# EAGLE design altimeter_new (EAGLE 9.3.1)
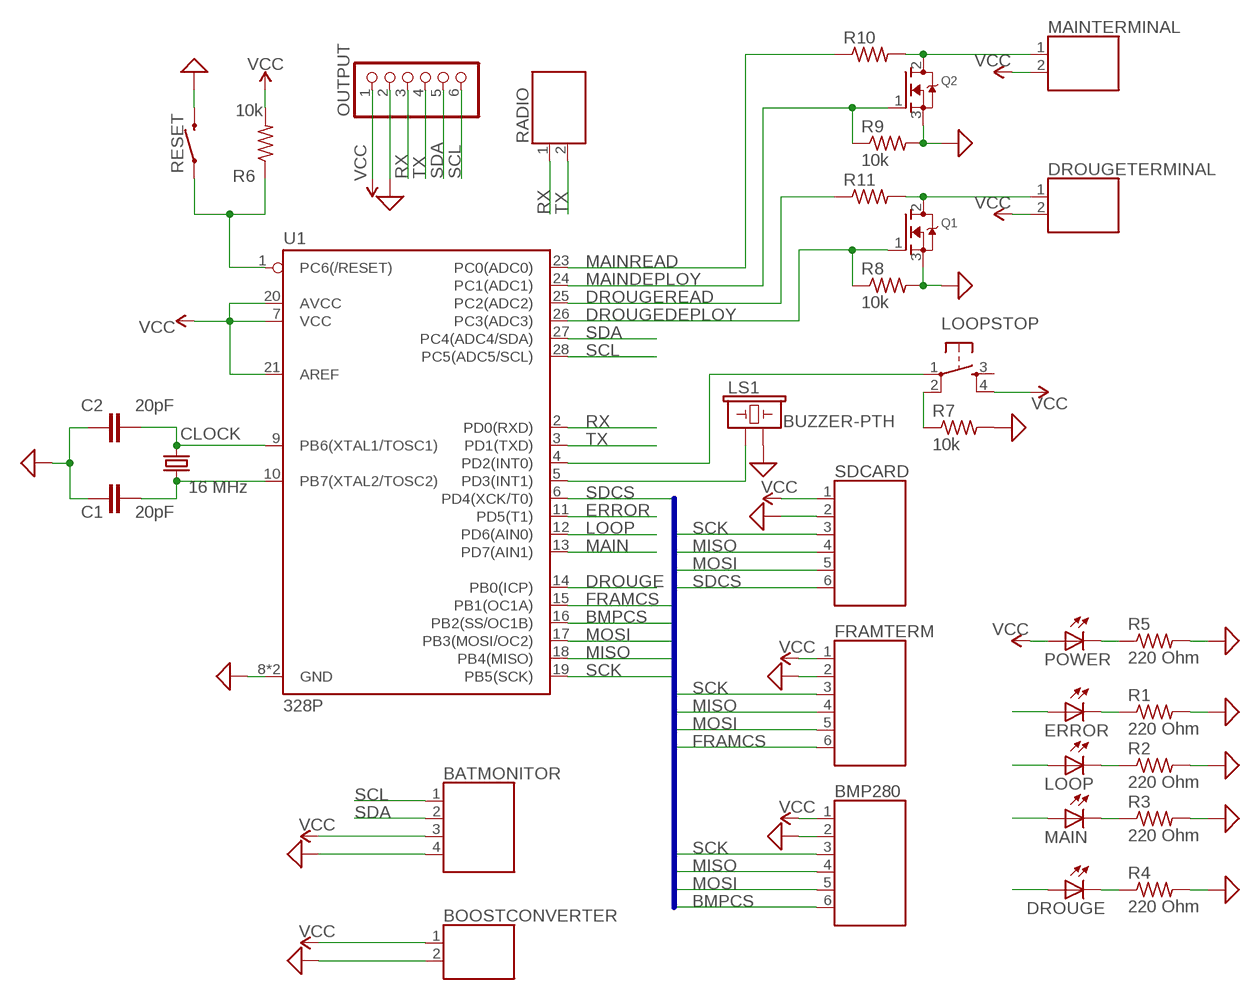
[diagram p0: schematic, sheet 1]

## Parts
BATMONITOR  691386700004  [691386700004]
BMP280  691386700006  [691386700006]
BOOSTCONVERTER  691386700002  [691386700002]
C1  20pF  22PF-PTH-2.54MM-200V-5%  [CAP-PTH-2.54]
C2  20pF  22PF-PTH-2.54MM-200V-5%  [CAP-PTH-2.54]
CLOCK  16 MHz  CRYSTALHC49U-V  [HC49U-V]
DROUGE  LED5MM  [LED5MM]
DROUGETERMINAL  691386700002  [691386700002]
ERROR  LED5MM  [LED5MM]
FRAMTERM  691386700006  [691386700006]
LOOP  LED5MM  [LED5MM]
LOOPSTOP  TAC_SWITCHPTH  [TACTILE-PTH]
LS1  BUZZER-PTH  [BUZZER-12MM]
MAIN  LED5MM  [LED5MM]
MAINTERMINAL  691386700002  [691386700002]
OUTPUT  PINHD-1X6  [1X06]
POWER  LED5MM  [LED5MM]
Q1  MOSFET-NGDS_TO220V  [TO220V]
Q2  MOSFET-NGDS_TO220V  [TO220V]
R1  220 Ohm  R-US_0204/7  [0204/7]
R2  220 Ohm  R-US_0204/7  [0204/7]
R3  220 Ohm  R-US_0204/7  [0204/7]
R4  220 Ohm  R-US_0204/7  [0204/7]
R5  220 Ohm  R-US_0204/7  [0204/7]
R6  10k  R-US_0204/7  [0204/7]
R7  10k  R-US_0204/7  [0204/7]
R8  10k  R-US_0204/7  [0204/7]
R9  10k  R-US_0204/7  [0204/7]
R10  R-US_0204/7  [0204/7]
R11  R-US_0204/7  [0204/7]
RADIO  691386700002  [691386700002]
RESET  MOMENTARY-SWITCH-SPST-PTH-6.0MM  [TACTILE_SWITCH_PTH_6.0MM]
SDCARD  691386700006  [691386700006]
U1  328P  ATMEGA328P_PDIP  [DIP28]

## Nets
BMPCS: BMP280.6 U1.16(PB2(SS/OC1B))
DROUGE: DROUGE.A U1.14(PB0(ICP))
DROUGEDEPLOY: Q1.1(G) R8.1 U1.26(PC3(ADC3))
DROUGEREAD: R11.1 U1.25(PC2(ADC2))
ERROR: ERROR.A U1.11(PD5(T1))
FRAMCS: FRAMTERM.6 U1.15(PB1(OC1A))
GND: BATMONITOR.4 BMP280.2 BOOSTCONVERTER.2 C1.1 C2.1 FRAMTERM.2 LS1.- OUTPUT.2 Q1.3(S) Q2.3(S) R1.2 R2.2 R3.2 R4.2 R5.2 R7.2 R8.2 R9.2 RESET.3 SDCARD.2 U1.8(GND) U1.22(GND) ; supply symbol labelled SUP
LOOP: LOOP.A U1.12(PD6(AIN0))
MAIN: MAIN.A U1.13(PD7(AIN1))
MAINDEPLOY: Q2.1(G) R9.1 U1.24(PC1(ADC1))
MAINREAD: R10.1 U1.23(PC0(ADC0))
MISO: BMP280.4 FRAMTERM.4 SDCARD.4 U1.18(PB4(MISO))
MOSI: BMP280.5 FRAMTERM.5 SDCARD.5 U1.17(PB3(MOSI/OC2))
N$1: C1.2 CLOCK.1 U1.10(PB7(XTAL2/TOSC2))
N$2: C2.2 CLOCK.2 U1.9(PB6(XTAL1/TOSC1))
N$3: POWER.K(C) R5.1
N$4: LOOPSTOP.2 R7.1
N$5: LOOPSTOP.1 U1.4(PD2(INT0))
N$7: LS1.+ U1.5(PD3(INT1))
N$11: DROUGETERMINAL.1 Q1.2(D) R11.2
N$12: ERROR.K(C) R1.1
N$13: LOOP.K(C) R2.1
N$14: MAIN.K(C) R3.1
N$15: DROUGE.K(C) R4.1
N$19: MAINTERMINAL.1 Q2.2(D) R10.2
N$21: R6.1 RESET.1 U1.1(PC6(/RESET))
RX: OUTPUT.3 RADIO.1 U1.2(PD0(RXD))
SCK: BMP280.3 FRAMTERM.3 SDCARD.3 U1.19(PB5(SCK))
SCL: BATMONITOR.1 OUTPUT.6 U1.28(PC5(ADC5/SCL))
SDA: BATMONITOR.2 OUTPUT.5 U1.27(PC4(ADC4/SDA))
SDCS: SDCARD.6 U1.6(PD4(XCK/T0))
TX: OUTPUT.4 RADIO.2 U1.3(PD1(TXD))
VCC: BATMONITOR.3 BMP280.1 BOOSTCONVERTER.1 DROUGETERMINAL.2 FRAMTERM.1 LOOPSTOP.4 MAINTERMINAL.2 OUTPUT.1 POWER.A R6.2 SDCARD.1 U1.7(VCC) U1.20(AVCC) U1.21(AREF)
Unconnected: LOOPSTOP.3

## Buses
SPIBUS:BMPCS,FRAMCS,GND,MISO,MOSI,SCK,SDCS,VCC

## Library data of the parts
BATMONITOR = Wurth_Elektronik_Electromechanic_Terminal_Blocks_Connectors_rev18a:691386700004: WR-TBL Terminal block - CUM5/4 - 4 Pins;=>Code : Con_TBL_Pluggable_5.00_6913867000xx_691386700004 <http://katalog.we-online.de/media/images/v2/Family_WR-TBL_Serie_386_6913867000xx.jpg> Details see: http://katalog.we-online.de/em/datasheet/6913867000xx.pdf Created 11/3/2014, Karrer Zheng 2014 (C) Wurth Elektronik
BMP280 FRAMTERM SDCARD = Wurth_Elektronik_Electromechanic_Terminal_Blocks_Connectors_rev18a:691386700006: WR-TBL Terminal block - CUM5/6 - 6 Pins;=>Code : Con_TBL_Pluggable_5.00_6913867000xx_691386700006 <http://katalog.we-online.de/media/images/v2/Family_WR-TBL_Serie_386_6913867000xx.jpg> Details see: http://katalog.we-online.de/em/datasheet/6913867000xx.pdf Created 11/3/2014, Karrer Zheng 2014 (C) Wurth Elektronik
BOOSTCONVERTER DROUGETERMINAL MAINTERMINAL RADIO = Wurth_Elektronik_Electromechanic_Terminal_Blocks_Connectors_rev18a:691386700002: WR-TBL Terminal block - CUM5/2 - 2 Pins;=>Code : Con_TBL_Pluggable_5.00_6913867000xx_691386700002 <http://katalog.we-online.de/media/images/v2/Family_WR-TBL_Serie_386_6913867000xx.jpg> Details see: http://katalog.we-online.de/em/datasheet/6913867000xx.pdf Created 11/3/2014, Karrer Zheng 2014 (C) Wurth Elektronik
C1 C2 = SparkFun-Capacitors:22PF: 22pF ceramic capacitors A capacitor is a passive two-terminal electrical component used to store electrical energy temporarily in an electric field.; PROD_ID: CAP-09128; SPICEPREFIX: C; VALUE: 22pF
CLOCK = adafruit:CRYSTAL: CRYSTAL; OC_FARNELL: 1666969; OC_NEWARK: unknown; SPICEPREFIX: C
DROUGE ERROR LOOP MAIN POWER = adafruit:LED: LED OSRAM: - CHIPLED LG R971, LG N971, LY N971, LG Q971, LY Q971, LO R971, LY R971 LH N974, LH R974 LS Q976, LO Q976, LY Q976 LO Q996 - Hyper CHIPLED LW Q18S LB Q993, LB Q99A, LB R99A - SideLED LS A670, LO A670, LY A670, LG A670, LP A670 LB A673, LV A673, LT A673, LW A673 LH A674 LY A675 LS A676, LA A676, LO A676, LY A676, LW A676 LS A679, LY A679, LG A679 - Hyper Micro SIDELED® LS Y876, LA Y876, LO Y876, LY Y876 LT Y87S - SmartLED LW L88C, LW L88S LB L89C, LB L89S, LG L890 LS L89K, LO L89K, LY L89K LS L896, LA L896, LO L896, LY L896 - TOPLED LS T670, LO T670, LY T670, LG T670, LP T670 LSG T670, LSP T670, LSY T670, LOP T670, LYG T670 LG T671, LOG T671, LSG T671 LB T673, LV T673, LT T673, LW T673 LH T674 LS T676, LA T676, LO T676, LY T676, LB T676, LH T676, LSB T676, LW T676 LB T67C, LV T67C, LT T67C, LS T67K, LO T67K, LY T67K, LW E67C LS E67B, LA E67B, LO E67B, LY E67B, LB E67C, LV E67C, LT E67C LW T67C LS T679, LY T679, LG T679 LS T770, LO T770, LY T770, LG T770, LP T770 LB T773, LV T773, LT T773, LW T773 LH T774 LS E675, LA E675, LY E675, LS T675 LS T776, LA T776, LO T776, LY T776, LB T776 LHGB T686 LT T68C, LB T68C - Hyper Mini TOPLED® LB M676 - Mini TOPLED Santana® LG M470 LS M47K, LO M47K, LY M47K Source: http://www.osram.convergy.de/
LOOPSTOP = SparkFun-Retired:TAC_SWITCH: Momentary Switch Button commonly used for reset or general input. Spark Fun Electronics SKU : COM-00097 SMT- SWCH-08247
LS1 = SparkFun-Electromechanical:BUZZER: Buzzer Small round buzzers that operate around the audible 2kHz range. You can use these as speakers to create simple music or user interfaces. Variant Overview: PTH - Mini Speaker - PC Mount 12mm 2.048kHz <https://www.sparkfun.com/products/7950> PTH_KIT - Mini Speaker - PC Mount 12mm 2.048kHz <https://www.sparkfun.com/products/7950> KIT simplifies soldering by adding stop mask to one side of the pads. PTH_NO_SILK - Mini Speaker - PC Mount 12mm 2.048kHz <https://www.sparkfun.com/products/7950> No silkscreen indicator of buzzer outline. PTH_KIT_NO_SILK - Mini Speaker - PC Mount 12mm 2.048kHz <https://www.sparkfun.com/products/7950> KIT package w/o silkscreen SMD - Buzzer Audio Magnetic (CCV-084B16) SMD buzzer used on, e.g. the LilyPad Buzzer <https://www.sparkfun.com/products/8463> and RFID USB Reader <https://www.sparkfun.com/products/9963>. SMD_KIT - Buzzer Audio Magnetic (CCV-084B16) SMD Buzzer with elongated pins to make soldering easier. Used on the SparkFun Simon Says - Surface Mount Soldering Kit <https://www.sparkfun.com/products/10935>.; PROD_ID: COMP-08253; SF_SKU: COM-07950
OUTPUT = pinhead:PINHD-1X6: PIN HEADER
Q1 Q2 = adafruit:MOSFET-N: N-Channel Mosfet 2N7002E - 60V 260mA SOT23 [Digikey: 2N7002ET1GOSTR-ND] - REEL BSH103 - 30V 850mA SOT23 [Digikey: 568-5013-1-ND]
R1-R11 = adafruit:R-US_: RESISTOR, American symbol
RESET = SparkFun-Switches:MOMENTARY-SWITCH-SPST: Momentary Switch (Pushbutton) - SPST Normally-open (NO) SPST momentary switches (buttons, pushbuttons). Variants PTH-12MM - 12mm square, through-hole Momentary Pushbutton Switch - 12mm Square <https://www.sparkfun.com/products/9190> (COM-09190) PTH-6.0MM, PTH-6.0MM-KIT - 6.0mm square, through-hole Mini Pushbutton Switch <https://www.sparkfun.com/products/97> (COM-00097) KIT package intended for soldering kit's - only one side of pads' copper is exposed. PTH-RIGHT-ANGLE-KIT - Right-angle, through-hole Right Angle Tactile Button <https://www.sparkfun.com/products/10791> - Used on SparkFun BigTime Watch Kit <https://www.sparkfun.com/products/11734> SMD-12MM - 12mm square, surface-mount Tactile Button - SMD (12mm) <https://www.sparkfun.com/products/12993> (COM-12993) Used on SparkFun PicoBoard <https://www.sparkfun.com/products/11888> SMD-4.5MM - 4.5mm Square Trackball Switch Used on SparkFun Blackberry Trackballer Breakout <https://www.sparkfun.com/products/13169> SMD-4.6MMX2.8MM - 4.60mm x 2.80mm, surface mount Used on SparkFun SAMD21 Mini Breakout <https://www.sparkfun.com/products/13664> SMD-5.2MM, SMD-5.2-REDUNDANT - 5.2mm square, surface-mount Mini Pushbutton Switch - SMD <https://www.sparkfun.com/products/8720> (COM-08720) Used on Arduino Pro Mini <https://www.sparkfun.com/products/11114> REDUNDANT package connects both switch circuits together SMD-6.0X3.5MM - 6.0 x 3.5mm, surface mount Momentary Reset Switch SMD <https://www.sparkfun.com/products/8229> (COM-08229) SMD-6.2MM-TALL - 6.2mm square, surface mount Tactile Button - SMD (6mm) <https://www.sparkfun.com/products/12992> Used on SparkFun Digital Sandbox <https://www.sparkfun.com/products/12651> SMD-RIGHT-ANGLE - Right-angle, surface mount Used on SparkFun Block for Intel® Edison - Arduino <https://www.sparkfun.com/products/13036>; PROD_ID: SWCH-08441; SF_SKU: COM-00097
U1 = SparkFun-IC-Microcontroller:ATMEGA328P_PDIP: Atmel 328P Through hole ATMEGA328P uC used in the Arduino 32kb flash, 1k EEPROM, 2k SRAM Datasheet <http://www.sparkfun.com/datasheets/Components/SMD/ATMega328.pdf> SparkFun Products Storefront component: AVR 28 Pin 20MHz 32K 6A/D - ATMega328P <https://www.sparkfun.com/products/9061> (COM-09061) SparkFun Simon Says - Through-Hole Soldering Kit <https://www.sparkfun.com/products/10547> (KIT-10547) SparkFun Learn to Solder - Simon Says <https://www.sparkfun.com/products/13708> (KIT-13708) SparkFun BigTime Watch Kit <https://www.sparkfun.com/products/11734> (KIT-11734) SparkFun ClockIt <https://www.sparkfun.com/products/10930> (KIT-10930) SparkFun Serial Enabled LCD Kit <https://www.sparkfun.com/products/10097> (LCD-10097) SparkFun Simon Tilts - Through Hole Soldering Kit <https://www.sparkfun.com/products/12634> (KIT-12634) SparkFun Frequency Counter Kit <https://www.sparkfun.com/products/10140> (KIT-10140) FabFM Radio Kit <https://www.sparkfun.com/products/11043> (KIT-11043) SparkFun Binary Blaster Kit <https://www.sparkfun.com/products/12037> (KIT-12037) SparkFun Metro-Gnome <https://www.sparkfun.com/products/9236> (KIT-09236) ATmega328 with Arduino Optiboot (Uno) <https://www.sparkfun.com/products/10524> (DEV-10524); PROD_ID: IC-09136

## Board
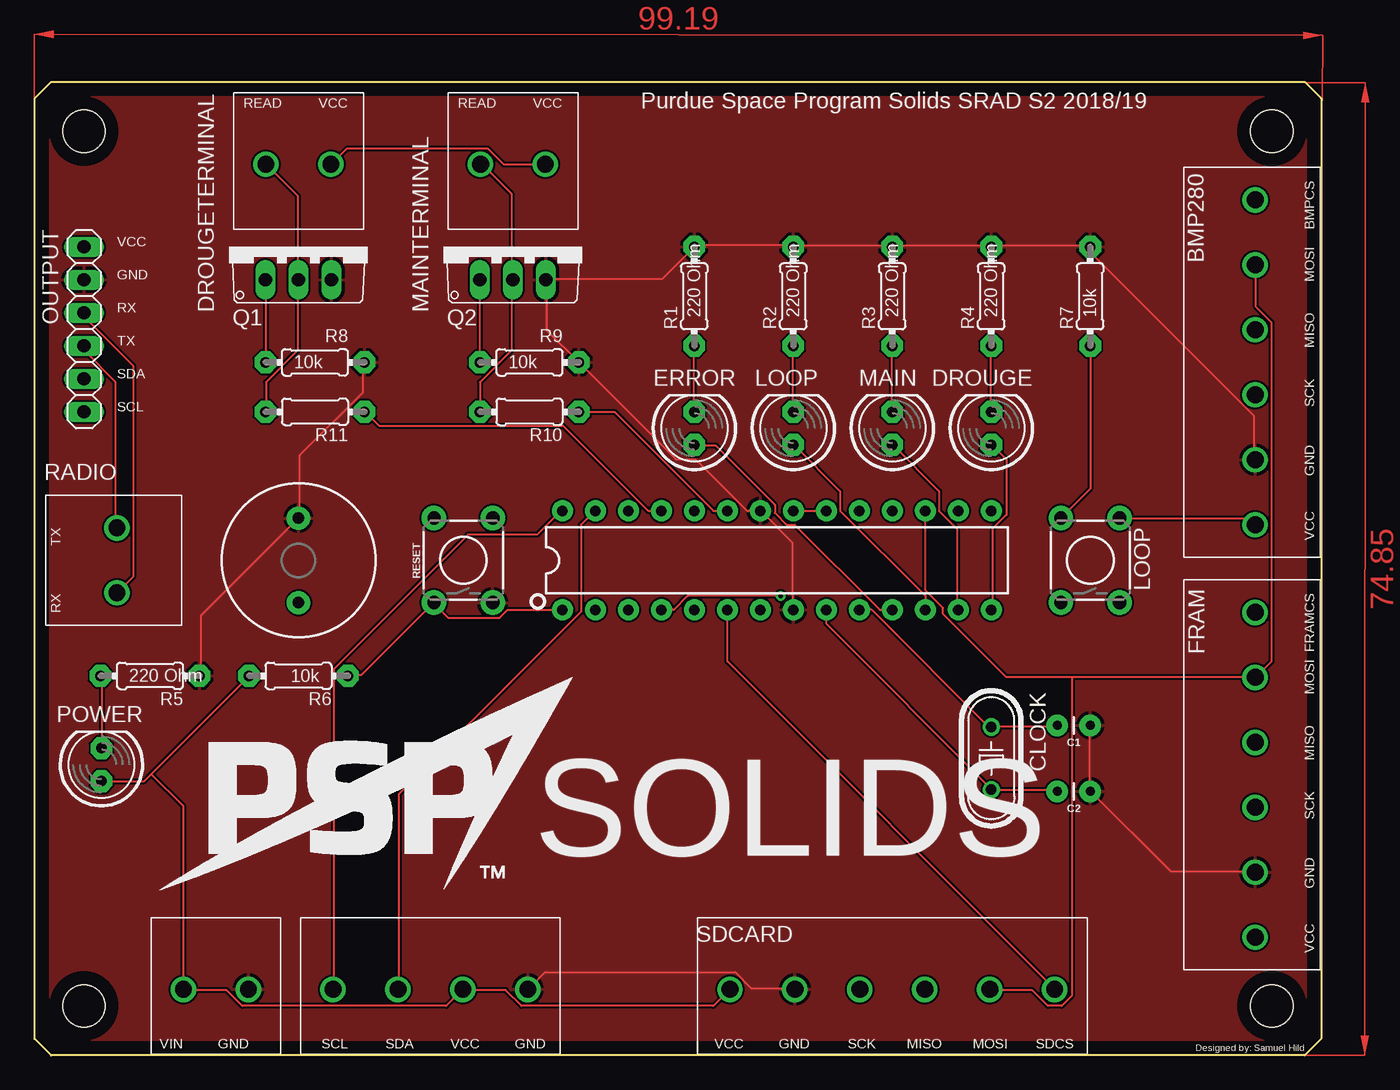
[diagram p1: board, top side]
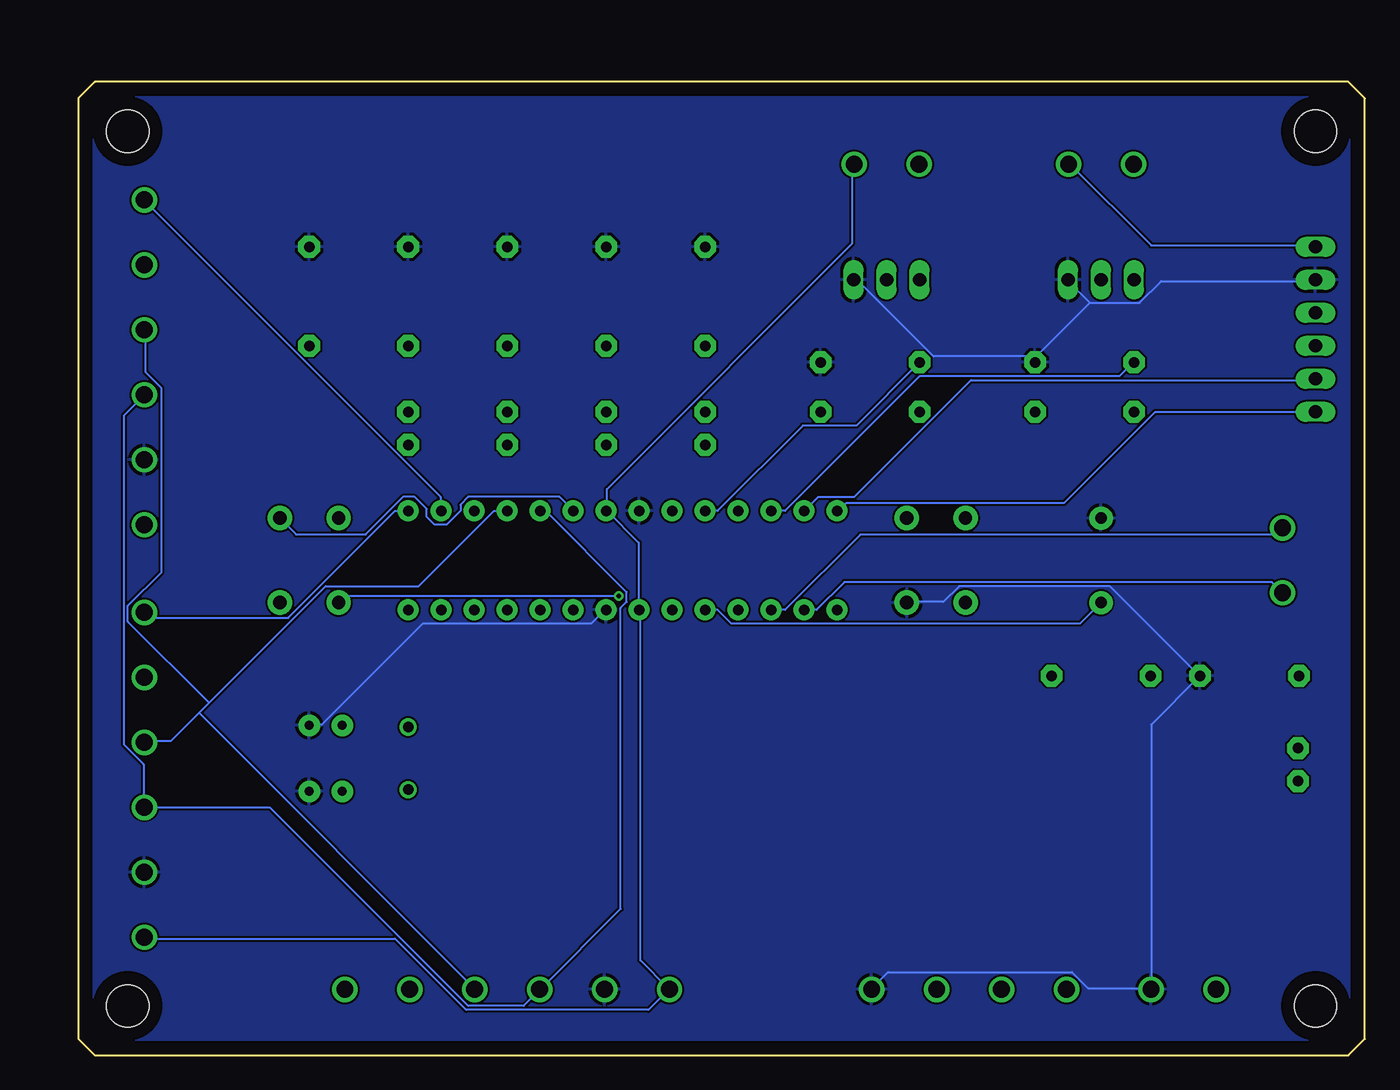
[diagram p2: board, bottom side, seen from below]

Size 99.06 x 74.93 mm. Coordinates in mm from the lower left corner, seen from the top.
Outline: 0,1.27 0,73.66 1.27,74.93 97.79,74.93 99.06,73.66 99.06,1.27 97.79,0 1.27,0 0,1.27
Copper layers (1*16): Top 0.035mm / dielectric 1.5mm / Bottom 0.035mm
Design rules "default": minimum track width 6mil, minimum drill 0.35mm, track to track 6mil, track to pad 6mil, pad to pad 6mil, via to via 6mil, smd to smd 6mil, copper to edge 40mil, drill to drill 6mil, minimum pad ring 10mil, minimum via ring 8mil, stop-mask expansion 4mil, vias tented up to drill 0mil, thermal gap 10mil
Holes 3.26 mm at 95.25,3.81 95.25,71.12 3.81,71.12 3.81,3.81

### Footprints (pad centres in the part's own frame; a part is rotated, then mirrored left to right if it is on the bottom)
691386700004 = drill 1.3: 1 -7.5,0; 2 -2.5,0; 3 2.5,0; 4 7.5,0
691386700006 = drill 1.3: 1 -12.5,0; 2 -7.5,0; 3 -2.5,0; 4 2.5,0; 5 7.5,0; 6 12.5,0
691386700002 = drill 1.3: 1 -2.5,0; 2 2.5,0
CAP-PTH-2.54 = drill 0.7 pad 1.651: 1 -1.27,0; 2 1.27,0
HC49U-V = drill 0.813: 1 -2.413,0; 2 2.413,0
LED5MM = drill 0.813 pad 1.676 octagon: A -1.27,0; K 1.27,0
TACTILE-PTH = drill 1.016 pad 1.88: 1 -3.251,2.261; 2 3.251,2.261; 3 -3.251,-2.261; 4 3.251,-2.261
BUZZER-12MM = drill 0.9 pad 1.778: + 3.25,0; - -3.25,0
1X06 = drill 1.016 long: 1 -6.35,0; 2 -3.81,0; 3 -1.27,0; 4 1.27,0; 5 3.81,0; 6 6.35,0
TO220V = drill 1.016 long: 1 -2.54,-2.54; 2 0,-2.54; 3 2.54,-2.54
0204/7 = drill 0.813 pad 1.676 octagon: 1 -3.81,0; 2 3.81,0
TACTILE_SWITCH_PTH_6.0MM = drill 1.016 pad 1.88: 1 -3.251,2.261; 2 3.251,2.261; 3 -3.251,-2.261; 4 3.251,-2.261
DIP28 = drill 0.813 pad 1.626: 1 -16.51,-3.81; 2 -13.97,-3.81; 3 -11.43,-3.81; 4 -8.89,-3.81; 5 -6.35,-3.81; 6 -3.81,-3.81; 7 -1.27,-3.81; 8 1.27,-3.81; 9 3.81,-3.81; 10 6.35,-3.81; 11 8.89,-3.81; 12 11.43,-3.81; 13 13.97,-3.81; 14 16.51,-3.81; 15 16.51,3.81; 16 13.97,3.81; 17 11.43,3.81; 18 8.89,3.81; 19 6.35,3.81; 20 3.81,3.81; 21 1.27,3.81; 22 -1.27,3.81; 23 -3.81,3.81; 24 -6.35,3.81; 25 -8.89,3.81; 26 -11.43,3.81; 27 -13.97,3.81; 28 -16.51,3.81

### Placement (x,y rotation side)
BATMONITOR  30.48,5.08 0 top
BMP280  93.98,53.34 90 top
BOOSTCONVERTER  13.97,5.08 0 top
C1  80.01,25.4 180 top
C2  80.01,20.32 180 top
CLOCK  73.66,22.86 270 top
DROUGE  73.66,48.26 90 top
DROUGETERMINAL  20.32,68.58 0 top
ERROR  50.8,48.26 90 top
FRAMTERM  93.98,21.59 90 top
LOOP  58.42,48.26 90 top
LOOPSTOP  81.28,38.1 90 top
LS1  20.32,38.1 270 top
MAIN  66.04,48.26 90 top
MAINTERMINAL  36.83,68.58 0 top
OUTPUT  3.81,55.88 270 top
POWER  5.16,22.38 90 top
Q1  20.32,62.23 0 top
Q2  36.83,62.23 0 top
R1  50.8,58.42 90 top
R2  58.42,58.42 90 top
R3  66.04,58.42 90 top
R4  73.66,58.42 90 top
R5  8.89,29.21 0 top
R6  20.32,29.21 180 top
R7  81.28,58.42 90 top
R8  21.59,53.34 0 top
R9  38.1,53.34 0 top
R10  38.1,49.53 180 top
R11  21.59,49.53 180 top
RADIO  6.35,38.1 90 top
RESET  33.02,38.1 90 top
SDCARD  66.04,5.08 0 top
U1  57.15,38.1 0 top

### Tracks (layer width: path | path; a pad name or v marks a point on that pad's centre or on a via)
BMPCS
  Bottom 0.152: U1.16 71.17,41.91 71.17,42.98 94.03,65.84 BMP280.6
DROUGE
  Top 0.152: U1.14 73.76,34.29 73.76,40.54 74.83,41.6 74.83,45.87 73.76,46.94 DROUGE.A
DROUGEDEPLOY
  Top 0.152: Q1.1 17.83,59.59 17.83,53.34 R8.1
  Bottom 0.152: U1.26 44.65,41.91 34.29,52.27 18.9,52.27 17.83,53.34 R8.1
DROUGEREAD
  Top 0.152: U1.25 47.24,41.91 40.69,48.46 26.52,48.46 25.45,49.53 R11.1
ERROR
  Top 0.152: U1.11 65.08,34.29 58.52,40.84 57.91,40.84 57,41.76 57,42.37 52.43,46.94 50.9,46.94 ERROR.A
FRAMCS
  Bottom 0.152: U1.15 74.68,41.91 82.91,33.68 93.57,33.68 93.88,33.98 FRAMTERM.6
GND
  Top 0.152: C1.1 81.23,25.3 81.23,20.42 C2.1 81.38,20.27 87.48,14.17 93.88,14.17 FRAMTERM.2 | U1.8 58.37,34.29 58.37,39.47 55.93,41.91 U1.22 54.86,41.91 50.9,45.87 49.38,45.87 R9.2 39.47,55.78 39.47,59.59 Q2.3 39.47,59.74 48.31,59.74 R1.2 50.9,62.33 58.37,62.33 R2.2 58.52,62.33 65.99,62.33 R3.2 66.14,62.33 73.61,62.33 R4.2 73.76,62.33 81.23,62.33 R7.2 81.38,62.18 81.38,61.72 93.88,49.23 93.88,45.87 BMP280.2 | SDCARD.2 58.52,5.18 55.17,5.18 53.95,6.4 39.32,6.4 38.1,5.18 BATMONITOR.4 | R5.2 12.8,29.26 12.8,33.83 20.27,41.3 LS1.- 20.42,41.45 20.42,46.18 25.3,51.05 25.3,53.34 R8.2
  Bottom 0.152: C1.1 81.23,25.45 80.31,25.45 72.54,33.22 59.59,33.22 58.52,34.29 U1.8 | BATMONITOR.4 37.95,5.18 36.73,6.4 22.55,6.4 21.34,5.18 16.61,5.18 BOOSTCONVERTER.2 16.46,5.18 16.46,25.45 R5.2 12.8,29.26 19.66,36.12 31.24,36.12 32.46,34.9 35.2,34.9 RESET.3 | 21.18,57.91 17.37,57.91 15.7,59.59 3.81,59.59 OUTPUT.2 | 21.18,57.91 22.86,59.59 Q1.3 | 25.3,53.8 25.3,53.34 R8.2 25.3,53.8 | 21.18,57.91 25.3,53.8 | 25.3,53.8 33.22,53.8 39.01,59.59 39.32,59.59 Q2.3
  pour Top: 0.05,73.69 0.05,1.24 1.32,-0.03 97.79,-0.03 97.87,0.05 99.01,1.19 99.01,1.24 99.01,73.66 97.82,74.85 1.22,74.85
  pour Bottom: 1.27,74.88 -0.03,73.58 -0.03,1.32 1.3,0 97.76,0 99.16,1.4 99.16,73.48 97.76,74.88
LOOP
  Top 0.152: U1.12 68.58,35.36 62.03,41.91 62.03,43.43 58.52,46.94 LOOP.A
MAIN
  Top 0.152: U1.13 71.02,34.29 71.02,40.54 69.65,41.91 69.65,43.43 66.14,46.94 MAIN.A
MAINDEPLOY
  Top 0.152: R9.1 Q2.1
  Bottom 0.152: U1.24 49.84,41.91 43.28,48.46 39.17,48.46 R9.1
MAINREAD
  Top 0.152: U1.23 52.27,41.91 44.65,49.53 R10.1
MISO
  Bottom 0.152: U1.18 67.06,41.91 72.85,36.12 80.01,36.12 89,27.13 | 89.76,26.36 91.9,24.23 93.88,24.23 FRAMTERM.4 | 89.76,26.36 89,27.13 | 89.76,26.36 68.58,5.18 SDCARD.4 | 89,27.13 95.25,33.38 95.25,34.59 92.66,37.19 92.66,51.36 93.88,52.58 93.88,55.78 BMP280.4
MOSI
  Top 0.152: U1.17 68.58,35.81 69.95,34.44 69.95,33.98 74.83,29.11 79.86,29.11 | 79.86,29.11 93.88,29.11 FRAMTERM.5 94.03,29.11 95.25,30.33 95.25,56.39 94.03,57.61 94.03,60.81 BMP280.5 | 79.86,29.11 79.86,4.57 79.1,3.81 78.03,3.81 76.81,5.03 73.61,5.03 SDCARD.5
N$1
  Top 0.152: C1.2 78.64,25.3 73.76,25.3 CLOCK.1 73.61,25.15 64.47,34.29 U1.10
N$2
  Top 0.152: C2.2 78.64,20.42 73.76,20.42 CLOCK.2 73.61,20.57 60.96,33.22 U1.9
N$3
  Top 0.152: R5.1 5.16,29.13 POWER.K
N$4
  Top 0.152: R7.1 81.28,43.61 LOOPSTOP.2
N$5  (via drill 0.35)
  Top 0.152: U1.4 49.23,34.29 50.29,35.36 v57.45,35.36
  Bottom 0.152: v57.45,35.36 78.49,35.36 78.94,34.9 LOOPSTOP.1
N$7
  Bottom 0.152: U1.5 49.84,34.29 48.77,33.22 21.95,33.22 20.42,34.75 LS1.+
N$11
  Top 0.152: DROUGETERMINAL.1 20.27,66.14 20.27,59.74 Q1.2 20.27,59.59 20.27,54.25 17.83,51.82 17.83,49.53 R11.2
N$12
  Top 0.152: ERROR.K 50.75,49.53 50.75,54.56 R1.1
N$13
  Top 0.152: LOOP.K 58.37,49.53 58.37,54.56 R2.1
N$14
  Top 0.152: MAIN.K 65.99,49.53 65.99,54.56 R3.1
N$15
  Top 0.152: DROUGE.K 73.61,49.53 73.61,54.56 R4.1
N$19
  Top 0.152: MAINTERMINAL.1 34.44,68.58 36.73,66.29 36.73,59.74 Q2.2 36.73,59.59 36.73,54.25 34.29,51.82 R10.2
N$21
  Top 0.152: U1.1 36.42,34.29 35.81,33.68 31.85,33.68 30.79,34.75 RESET.1 30.63,34.75 25.15,29.26 24.23,29.26 R6.1
RX
  Top 0.152: OUTPUT.3 3.81,56.84 7.62,53.03 7.62,36.88 6.4,35.66 RADIO.1
  Bottom 0.152: U1.2 42.22,34.29 40.08,36.42 7.16,36.42 6.4,35.66 RADIO.1
SCK
  Bottom 0.152: BMP280.3 94.03,50.75 95.56,49.23 95.56,23.93 94.03,22.4 94.03,19.2 FRAMTERM.3 93.88,19.05 84.28,19.05 69.04,3.81 64.77,3.81 63.55,5.03 SDCARD.3 63.4,5.18 57.3,11.28 57.3,34.44 56.84,34.9 56.84,35.66 63.09,41.91 U1.19
SCL
  Top 0.152: BATMONITOR.1 23.01,5.18 23.01,29.72 33.38,40.08 38.71,40.08 40.54,41.91 U1.28
  Bottom 0.152: OUTPUT.6 16.15,49.53 23.16,42.52 39.93,42.52 40.54,41.91 U1.28
SDA
  Top 0.152: BATMONITOR.2 28.04,5.18 28.04,20.12 42.06,34.14 42.06,40.84 43.13,41.91 U1.27
  Bottom 0.152: OUTPUT.5 3.81,51.97 30.33,51.97 39.32,42.98 42.06,42.98 43.13,41.91 U1.27
SDCS
  Top 0.152: U1.6 53.34,30.33 78.49,5.18 SDCARD.6
TX
  Top 0.152: OUTPUT.4 3.81,54.25 6.25,51.82 6.25,40.69 RADIO.2
  Bottom 0.152: U1.3 44.65,34.29 38.86,40.08 6.86,40.08 6.4,40.54 RADIO.2
VCC
  Top 0.152: MAINTERMINAL.2 36.12,68.58 34.9,69.8 24.08,69.8 22.86,68.58 DROUGETERMINAL.2 | 8.99,21.64 9.28,21.93 16.46,29.11 R6.2 | 8.99,21.64 11.43,19.2 11.43,5.18 BOOSTCONVERTER.1 11.58,5.03 14.78,5.03 16,3.81 31.7,3.81 32.92,5.03 BATMONITOR.3 33.07,5.03 36.27,5.03 37.49,3.81 52.27,3.81 53.49,5.03 SDCARD.1 | U1.21 U1.20 | LOOPSTOP.4 93.47,41.35 BMP280.1 | POWER.A 8.46,21.11 8.99,21.64
  Bottom 0.152: OUTPUT.1 3.81,62.33 16.46,62.33 22.71,68.58 DROUGETERMINAL.2 | 58.37,41.91 55.93,39.47 55.93,34.29 U1.7 55.78,34.29 55.78,7.32 53.65,5.18 SDCARD.1 53.65,5.03 55.17,3.5 69.19,3.5 74.68,8.99 93.88,8.99 FRAMTERM.1 | U1.20 62.03,42.98 69.04,42.98 69.65,42.37 69.65,41.91 70.71,40.84 71.63,40.84 72.24,41.45 72.24,42.06 73.15,42.98 74.07,42.98 76.94,40.11 82.3,40.11 LOOPSTOP.4 | 58.37,41.91 58.37,43.59 39.47,62.48 39.47,68.58 MAINTERMINAL.2 | 58.37,41.91 U1.21
(copper drawn outside any net)
  shapes: Top area x3

### Text on the board
tplace: READ | VCC | READ | VCC | Purdue Space Program Solids SRAD S2 2018/19 | BMPCS | VCC | MOSI | GND | RX | MISO | TX | SDA | SCK | SCL | GND | VCC | TX | RX | LOOP | FRAM | FRAMCS | MOSI | MISO | SCK | SOLIDS | GND | VCC | VIN | GND | SCL | SDA | VCC | GND | VCC | GND | SCK | MISO | MOSI | SDCS | Designed by: Samuel Hild